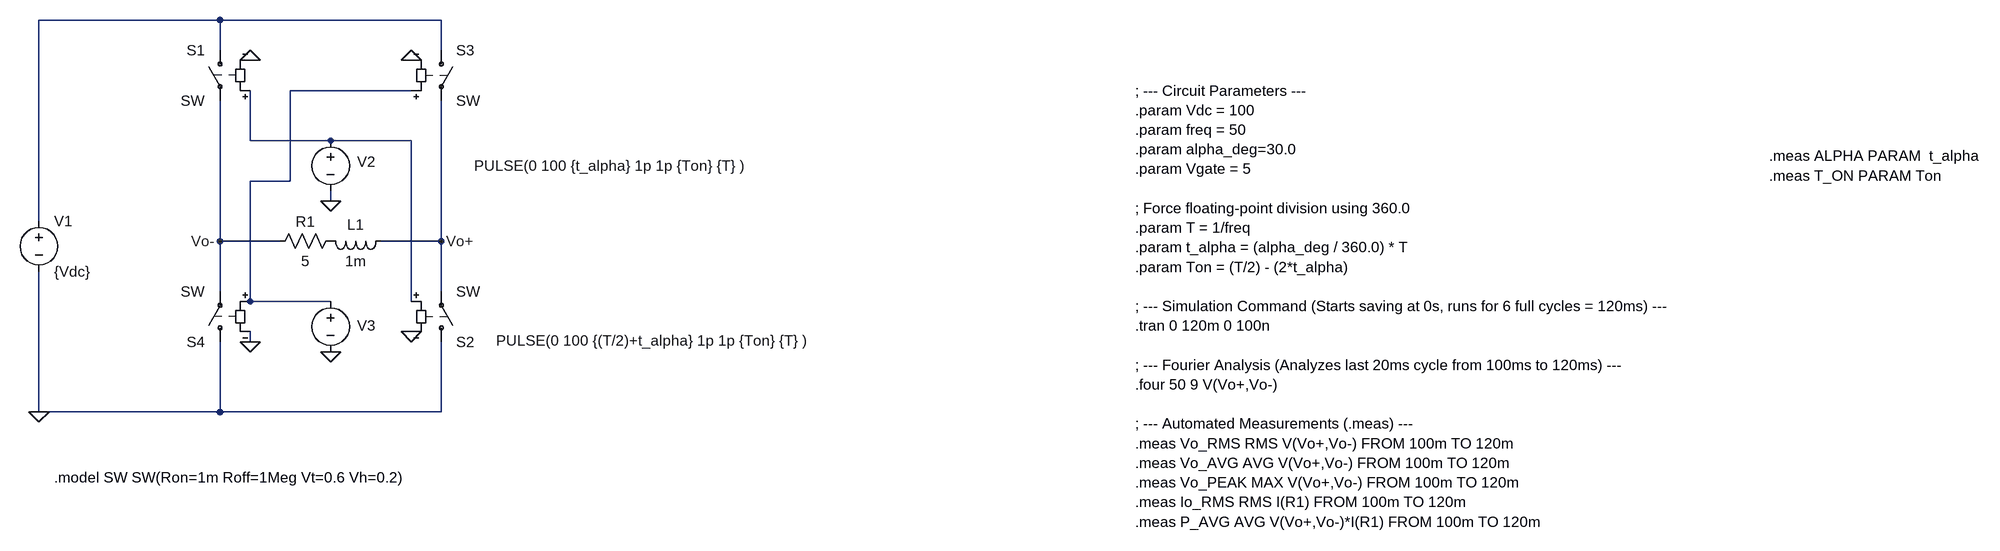
[diagram p0: schematic Draft1.asc]
Draft1.asc, the LTspice schematic file:
Version 4.1
SHEET 1 3232 864
WIRE 80 -192 -208 -192
WIRE 432 -192 80 -192
WIRE 80 -144 80 -192
WIRE 432 -144 432 -192
WIRE 384 -80 192 -80
WIRE 128 0 128 -80
WIRE 256 0 128 0
WIRE 384 0 256 0
WIRE 192 64 192 -80
WIRE 192 64 128 64
WIRE 256 96 256 80
WIRE -208 128 -208 -192
WIRE 80 160 80 -64
WIRE 176 160 80 160
WIRE 432 160 432 -64
WIRE 432 160 336 160
WIRE 80 240 80 160
WIRE 432 240 432 160
WIRE 128 256 128 64
WIRE 256 256 128 256
WIRE 384 256 384 0
WIRE 128 320 128 304
WIRE -208 432 -208 208
WIRE 80 432 80 320
WIRE 80 432 -208 432
WIRE 432 432 432 320
WIRE 432 432 80 432
FLAG 432 160 Vo+
FLAG 80 160 Vo-
FLAG 128 -128 0
FLAG 384 -128 0
FLAG 256 96 0
FLAG 384 304 0
FLAG 256 336 0
FLAG 128 320 0
FLAG -208 432 0
SYMBOL sw 80 -160 M0
SYMATTR InstName S1
SYMBOL sw 432 336 M180
SYMATTR InstName S2
SYMBOL sw 432 -160 R0
SYMATTR InstName S3
SYMBOL sw 80 336 R180
SYMATTR InstName S4
SYMBOL res 272 144 R90
WINDOW 0 0 56 VBottom 2
WINDOW 3 32 56 VTop 2
SYMATTR InstName R1
SYMATTR Value 5
SYMBOL ind 352 144 R90
WINDOW 0 5 56 VBottom 2
WINDOW 3 32 56 VTop 2
SYMATTR InstName L1
SYMATTR Value 1m
SYMATTR SpiceLine Rser=1m
SYMBOL voltage -208 112 R0
WINDOW 123 0 0 Left 0
WINDOW 39 0 0 Left 0
SYMATTR InstName V1
SYMATTR Value {Vdc}
SYMBOL voltage 256 -16 R0
WINDOW 0 42 49 Left 2
WINDOW 3 228 56 Left 2
WINDOW 123 0 0 Left 0
WINDOW 39 0 0 Left 0
SYMATTR InstName V2
SYMATTR Value PULSE(0 100 {t_alpha} 1p 1p {Ton} {T} )
SYMBOL voltage 256 240 R0
WINDOW 0 42 54 Left 2
WINDOW 3 263 78 Left 2
WINDOW 123 0 0 Left 0
WINDOW 39 0 0 Left 0
SYMATTR InstName V3
SYMATTR Value PULSE(0 100 {(T/2)+t_alpha} 1p 1p {Ton} {T} )
TEXT -184 536 Left 2 !.model SW SW(Ron=1m Roff=1Meg Vt=0.6 Vh=0.2)
TEXT 1536 -80 Left 2 !; --- Circuit Parameters ---\n.param Vdc = 100\n.param freq = 50\n.param alpha_deg=30.0\n.param Vgate = 5\n \n; Force floating-point division using 360.0\n.param T = 1/freq\n.param t_alpha = (alpha_deg / 360.0) * T\n.param Ton = (T/2) - (2*t_alpha)\n \n; --- Simulation Command (Starts saving at 0s, runs for 6 full cycles = 120ms) ---\n.tran 0 120m 0 100n\n \n; --- Fourier Analysis (Analyzes last 20ms cycle from 100ms to 120ms) ---\n.four 50 9 V(Vo+,Vo-)\n \n; --- Automated Measurements (.meas) ---\n.meas Vo_RMS RMS V(Vo+,Vo-) FROM 100m TO 120m\n.meas Vo_AVG AVG V(Vo+,Vo-) FROM 100m TO 120m\n.meas Vo_PEAK MAX V(Vo+,Vo-) FROM 100m TO 120m\n.meas Io_RMS RMS I(R1) FROM 100m TO 120m\n.meas P_AVG AVG V(Vo+,Vo-)*I(R1) FROM 100m TO 120m
TEXT 2544 24 Left 2 !.meas ALPHA PARAM  t_alpha\n.meas T_ON PARAM Ton

The netlist it stands for:
* Draft1.asc
S1 N001 Vo- N003 0 SW
S2 0 Vo+ N003 0 SW
S3 N001 Vo+ N002 0 SW
S4 0 Vo- N002 0 SW
R1 P001 Vo- 5
L1 Vo+ P001 1m Rser=1m
V1 N001 0 {Vdc}
V2 N003 0 PULSE(0 100 {t_alpha} 1p 1p {Ton} {T} )
V3 N002 0 PULSE(0 100 {(T/2)+t_alpha} 1p 1p {Ton} {T} )
.model SW SW(Ron=1m Roff=1Meg Vt=0.6 Vh=0.2)
; --- Circuit Parameters ---
.param Vdc = 100
.param freq = 50
.param alpha_deg=30.0
.param Vgate = 5
; Force floating-point division using 360.0
.param T = 1/freq
.param t_alpha = (alpha_deg / 360.0) * T
.param Ton = (T/2) - (2*t_alpha)
; --- Simulation Command (Starts saving at 0s, runs for 6 full cycles = 120ms) ---
.tran 0 120m 0 100n
; --- Fourier Analysis (Analyzes last 20ms cycle from 100ms to 120ms) ---
.four 50 9 V(Vo+,Vo-)
; --- Automated Measurements (.meas) ---
.meas Vo_RMS RMS V(Vo+,Vo-) FROM 100m TO 120m
.meas Vo_AVG AVG V(Vo+,Vo-) FROM 100m TO 120m
.meas Vo_PEAK MAX V(Vo+,Vo-) FROM 100m TO 120m
.meas Io_RMS RMS I(R1) FROM 100m TO 120m
.meas P_AVG AVG V(Vo+,Vo-)*I(R1) FROM 100m TO 120m
.meas ALPHA PARAM  t_alpha
.meas T_ON PARAM Ton
.backanno
.end